# Altium schematic sheet DIMNode012014.SchDoc
size C; SheetNumber: 0; SheetTotal: 0
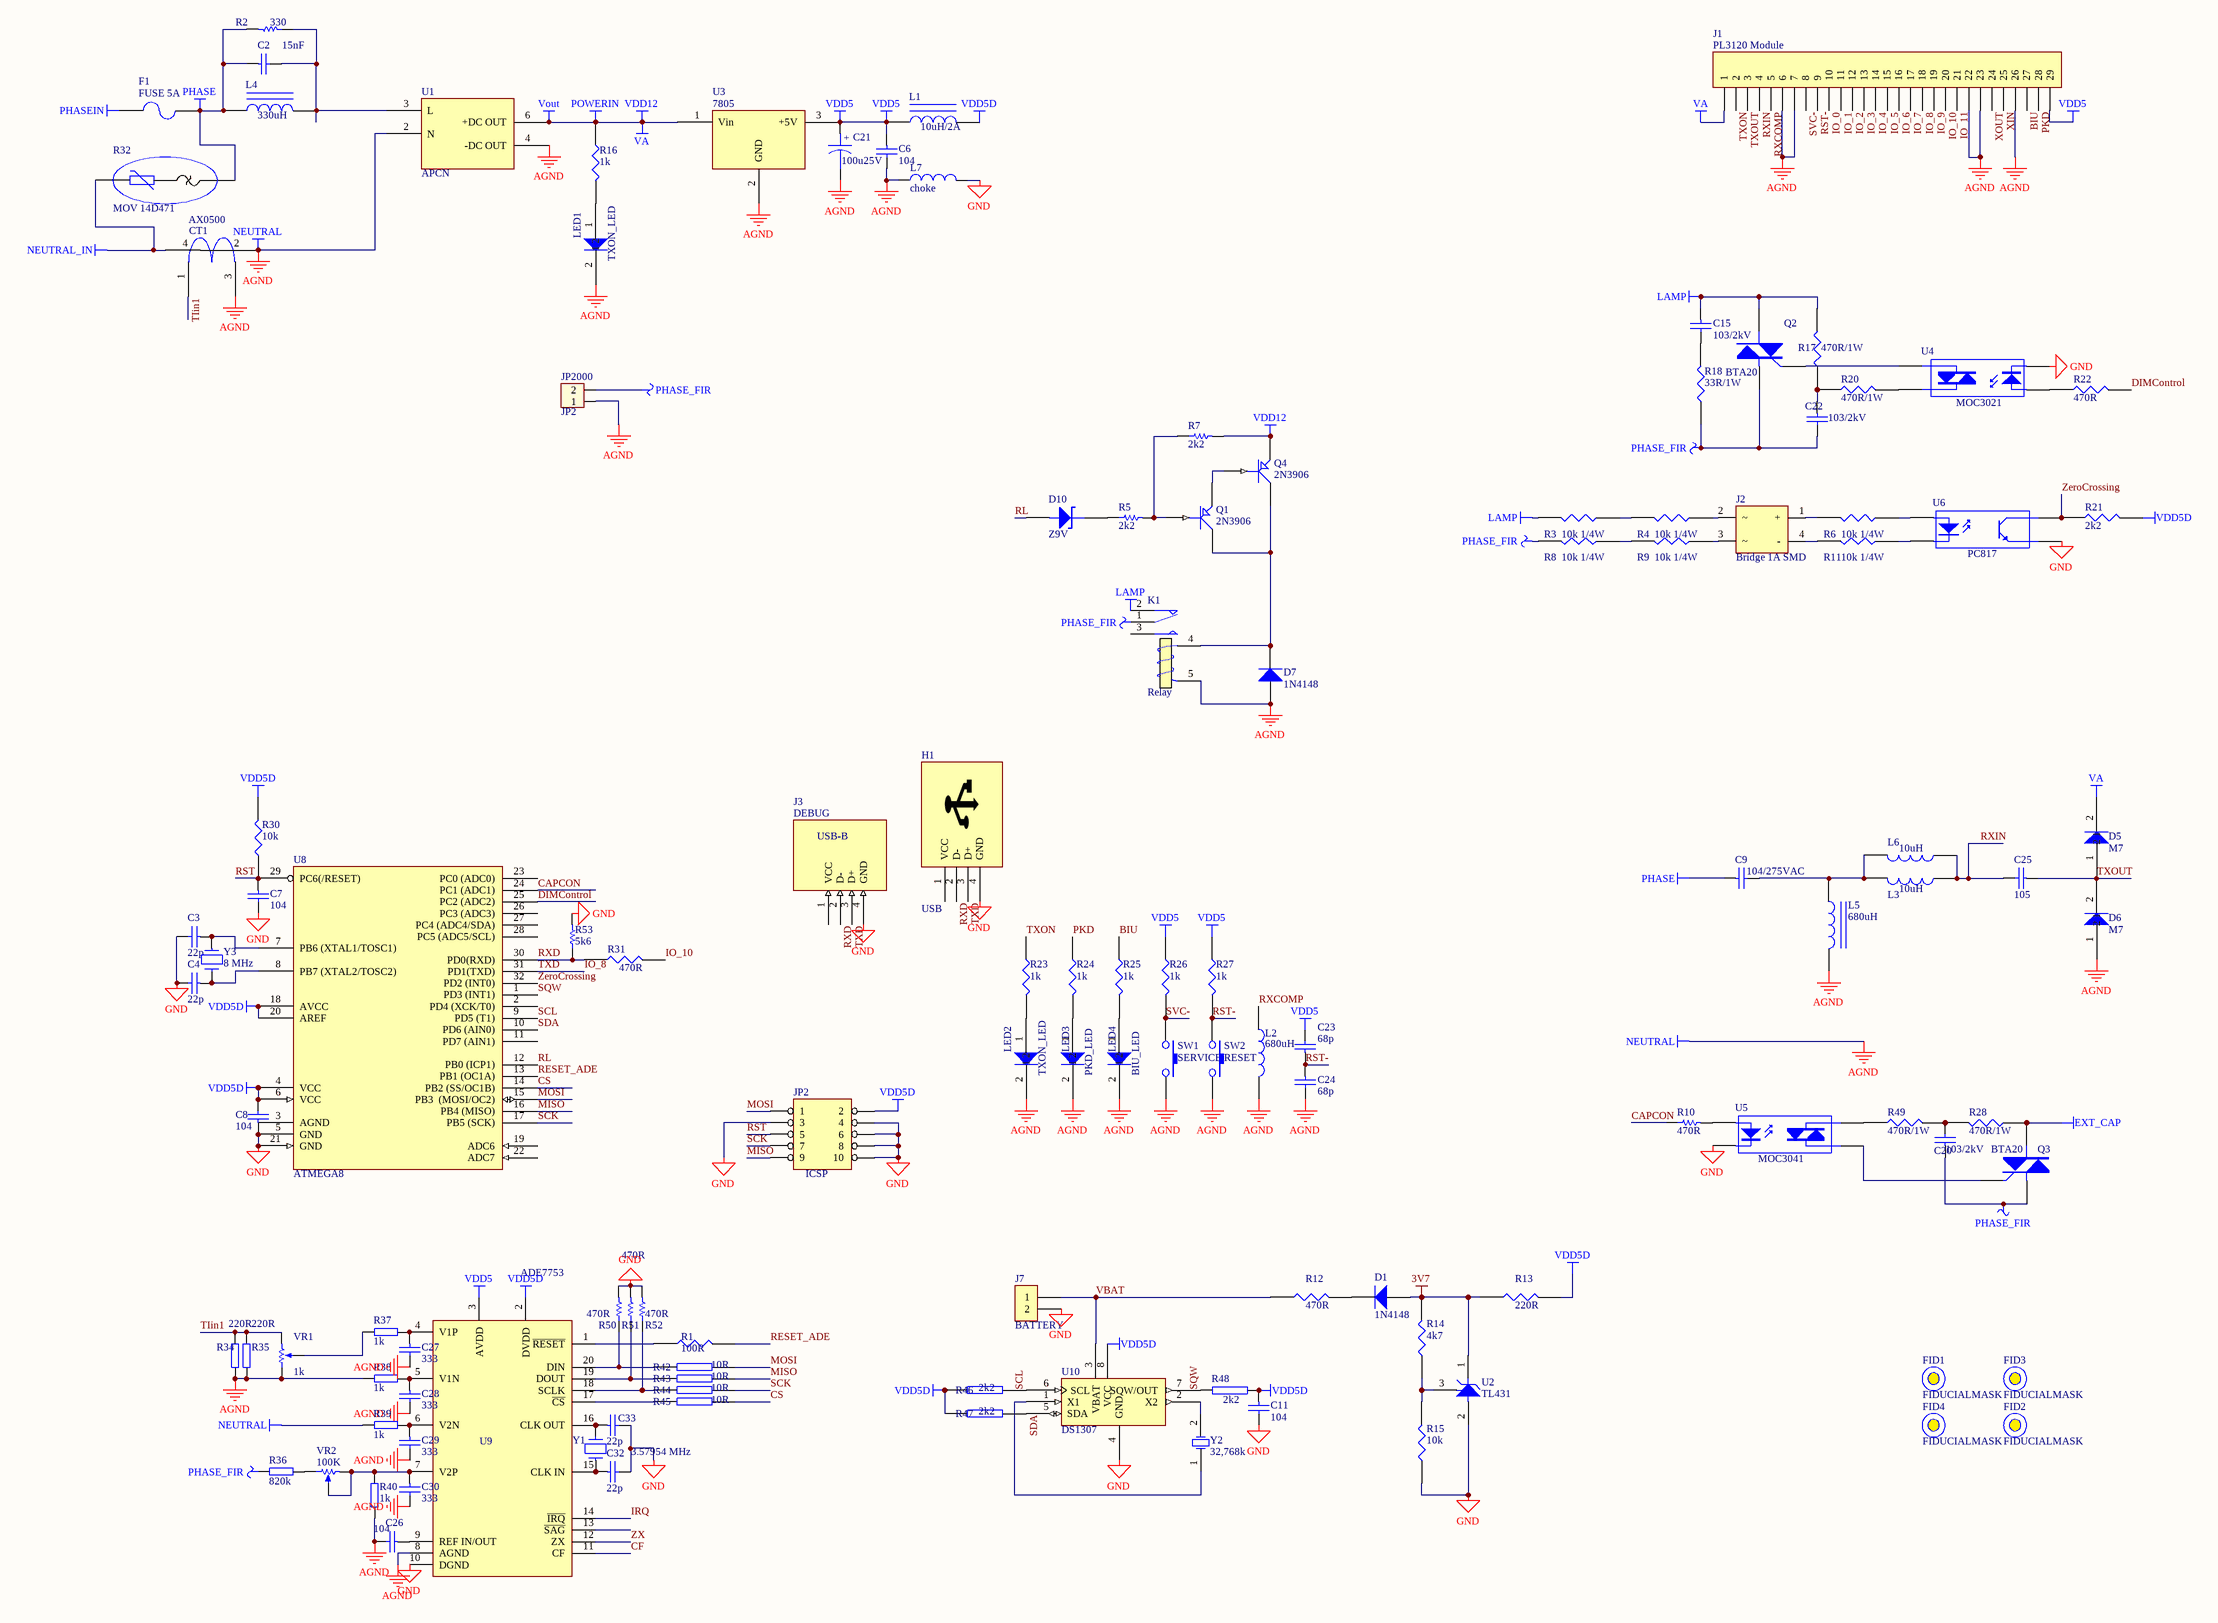
[diagram p0: DIMNode012014.SchDoc]

## Parts
C2  15nF  [CAPNTO5.08-7.37x3.94]
C3  22p  [2012[0805]]
C4  22p  [2012[0805]]
C6  104  [2012[0805]]
C7  104  [2012[0805]]
C8  104  [2012[0805]]
C9  104/275VAC  [100n400v]
C11  104  [2012[0805]]
C15  103/2kV  [104TO]
C20  103/2kV  [104TO]
C21  100u25V  [TC7360-2924]
C22  103/2kV  [104TO]
C23  68p  [2012[0805]]
C24  68p  [2012[0805]]
C25  105  [CSIP3]
C26  104  [2012[0805]]
C27  333  [2012[0805]]
C28  333  [2012[0805]]
C29  333  [2012[0805]]
C30  333  [2012[0805]]
C32  22p  [2012[0805]]
C33  22p  [2012[0805]]
CT1  AX0500  [CT-NHO]
D1  1N4148  [SOD-80/MLL34]
D5  M7  [MELF-D5022-2009]
D6  M7  [MELF-D5022-2009]
D7  1N4148  [SOD-80/MLL34]
D10  Z9V  [SOD-80/MLL34]
F1  FUSE 5A  [FUSE2]
FID1  FIDUCIALMASK  [FIDUCIALMASK]
FID2  FIDUCIALMASK  [FIDUCIALMASK]
FID3  FIDUCIALMASK  [FIDUCIALMASK]
FID4  FIDUCIALMASK  [FIDUCIALMASK]
H1  USB  [USB-B-STRANGE]
J1  PL3120 Module  [ECHELONMODULE]
J2  Bridge 1A SMD  [CAUSMD]
J3  DEBUG  [SJ-3515]
J7  BATTERY  [pincucao]
JP2  ICSP  [IDC10]
JP2000  JP2  [HED2]
K1  Relay  [Relayvuong]
L1  10uH/2A
L2  680uH  [AXIAL0.4]
L3  10uH  [AXIAL0.4]
L4  330uH  [CAMTRONDUNG]
L5  680uH  [axial0.4]
L6  10uH  [AXIAL0.4]
L7  choke  [axial0.3]
LED1  TXON_LED  [LED0805]
LED2  TXON_LED  [LED0805]
LED3  PKD_LED  [LED0805]
LED4  BIU_LED  [LED0805]
Q1  2N3906  [SOT-23]
Q2  BTA20  [TO254]
Q3  BTA20  [TO254]
Q4  2N3906  [SOT-23]
R1  100R  [2012[0805]]
R2  330  [3216[1206]]
R3  10k 1/4W  [3216[1206]]
R4  10k 1/4W  [3216[1206]]
R5  2k2  [2012[0805]]
R6  10k 1/4W  [3216[1206]]
R7  2k2  [2012[0805]]
R8  10k 1/4W  [3216[1206]]
R9  10k 1/4W  [3216[1206]]
R10  470R  [2012[0805]]
R11  10k 1/4W  [3216[1206]]
R12  470R  [2012[0805]]
R13  220R  [2012[0805]]
R14  4k7  [2012[0805]]
R15  10k  [2012[0805]]
R16  1k  [2012[0805]]
R17  470R/1W  [AXIAL0.5]
R18  33R/1W  [R1W_dung]
R20  470R/1W  [R1W_DUNG]
R21  2k2  [2012[0805]]
R22  470R  [2012[0805]]
R23  1k  [2012[0805]]
R24  1k  [2012[0805]]
R25  1k  [2012[0805]]
R26  1k  [2012[0805]]
R27  1k  [2012[0805]]
R28  470R/1W  [R1W_dung]
R30  10k  [2012[0805]]
R31  470R  [2012[0805]]
R32  MOV 14D471  [MOV471]
R34  220R  [2012[0805]]
R35  220R  [2012[0805]]
R36  820k  [1206]
R37  1k  [2012[0805]]
R38  1k  [2012[0805]]
R39  1k  [2012[0805]]
R40  1k  [2012[0805]]
R42  10R  [2012[0805]]
R43  10R  [2012[0805]]
R44  10R  [2012[0805]]
R45  10R  [2012[0805]]
R46  2k2  [2012[0805]]
R47  2k2  [2012[0805]]
R48  2k2  [2012[0805]]
R49  470R/1W  [R1W_DUNG]
R50  470R  [2012[0805]]
R51  470R  [2012[0805]]
R52  470R  [2012[0805]]
R53  5k6  [2012[0805]]
SW1  SERVICE  [CTCHIPNGANG]
SW2  RESET  [CTCHIPNGANG]
U1  APCN  [APCN]
U2  TL431  [TL431]
U3  7805  [J7805]
U4  MOC3021  [DIP6]
U5  MOC3041  [DIP6]
U6  PC817  [TLP521]
U8  ATMEGA8  [ATMEGA8]
U9  ADE7753  [ADE775X]
U10  DS1307  [SO-8]
VR1  1k  [BTXANH]
VR2  100K  [BTXANH]
Y1  3.57954 MHz  [XTAL]
Y2  32,768k  [R38]
Y3  8 MHz  [XTAL]

## Nets
3V7: D1.1(A) R13.1 R14.2 U2.1(K)
AGND: C6.2 C21.2 C24.2 C26.2 C27.2 C28.2 C29.2 C30.2 CT1.2(ACin) CT1.3(OUT2) D6.1 D7.1(A) J1.6 J1.7 J1.22 J1.23 J1.26 JP2000.1 K1.5(T2) L2.2 L5.2 L7.1 LED1.2 LED2.2 LED3.2 LED4.2 R34.1 R35.1 R38.2 R39.2 R40.1 SW1.2 SW2.2 U1.2(N) U1.4(-DC_OUT) U3.2(GND) U9.8(AGND) VR1.1(TOP)  [also labelled NEUTRAL]
EXT_CAP: Q3.2(T) R28.1
GND: C3.2 C4.2 C7.2 C8.1 C11.2 C32.2 C33.2 H1.4(GND) J3.4(GND) J7.2 JP2.3 JP2.4 JP2.6 JP2.8 JP2.10 L7.2 R15.1 R50.2 R51.2 R52.2 R53.2 U2.2(A) U4.2(K) U5.2(K) U6.4(E) U8.3(AGND) U8.5(GND) U8.21(GND) U9.10(DGND) U10.4(GND)
LAMP: C15.1 K1.2(NC) Q2.2(T) R3.2 R17.2
NEUTRAL_IN: CT1.4(ACout) R32.2
PHASE: C2.1 C9.1 F1.2 L4.1 R2.2 R32.1
PHASE_FIR: C20.1 C22.2 JP2000.2 K1.1(COM) Q2.1(T) Q3.1(T) R8.2 R18.1 R36.2
PHASEIN: F1.1
POWERIN: D5.2 J1.1 Q4.2(E) R7.2 R16.1 U1.6(+DC_OUT) U3.1(Vin)  [also labelled VA, VDD12, Vout]
VDD5: C6.1 C21.1 C23.2 J1.29 L1.1 R26.1 R27.1 U3.3(+5V) U9.3(AVDD)
VDD5D: C8.2 C11.1 JP2.2 L1.2 R13.2 R21.2 R30.2 R46.2 R47.2 R48.2 U8.4(VCC) U8.6(VCC) U8.18(AVCC) U8.20(AREF) U9.2(DVDD) U10.8(VCC)
BIU: J1.27 R25.1
CAPCON: R10.1 U8.24(PC1_(ADC1))
CF: U9.11(CF)
CS: R45.1 U8.14(PB2_(SS/OC1B))
DIMControl: R22.2 U8.25(PC2_(ADC2))
IO_0: J1.10
IO_1: J1.11
IO_2: J1.12
IO_3: J1.13
IO_4: J1.14
IO_5: J1.15
IO_6: J1.16
IO_7: J1.17
IO_8: H1.3(D+) J1.18 J3.3(D+) U8.31(PD1(TXD))  [also labelled TXD]
IO_9: J1.19
IO_10: J1.20 R31.2
IO_11: J1.21
IRQ: U9.14(~{IRQ})
MISO: JP2.9 R43.1 U8.16(PB4_(MISO))
MOSI: JP2.1 R42.1 U8.15(PB3__(MOSI/OC2))
PKD: J1.28 R24.1
RESET_ADE: R1.2 U8.13(PB1_(OC1A))
RL: D10.1(A) U8.12(PB0_(ICP1))
RST: C7.1 JP2.5 R30.1 U8.29(PC6(/RESET))
RST-: C23.1 C24.1 J1.9 R27.2 SW2.1
RXCOMP: J1.5 L2.1
RXD: H1.2(D-) J3.2(D-) R31.1 R53.1 U8.30(PD0(RXD))
RXIN: C25.2 J1.4 L3.1 L6.1
SCK: JP2.7 R44.1 U8.17(PB5_(SCK))
SCL: R46.1 U8.9(PD5_(T1)) U10.6(SCL)
SDA: R47.1 U8.10(PD6_(AIN0)) U10.5(SDA)
SQW: R48.1 U8.1(PD3_(INT1)) U10.7(SQW/OUT)
SVC-: J1.8 R26.2 SW1.1
TIin1: CT1.1(OUT1) R34.2 R35.2 VR1.3(BOT)
TXON: J1.2 R23.1
TXOUT: C25.1 D5.1 D6.2 J1.3
VBAT: J7.1 R12.1 U10.3(VBAT)
XIN: J1.25
XOUT: J1.24
ZeroCrossing: R21.1 U6.3(C) U8.32(PD2_(INT0))
ZX: U9.12(ZX)
NetC2_2: C2.2 L4.2 R2.1 U1.3(L)
NetC3_1: C3.1 U8.7(PB6_(XTAL1/TOSC1)) Y3.1
NetC4_1: C4.1 U8.8(PB7_(XTAL2/TOSC2)) Y3.2
NetC9_2: C9.2 L3.2 L5.1 L6.2
NetC15_2: C15.2 R18.2
NetC20_2: C20.2 R28.2 R49.2
NetC22_1: C22.1 R17.1 R20.1
NetC26_1: C26.1 U9.9(REF_IN/OUT)
NetC27_1: C27.1 R37.1 U9.4(V1P)
NetC28_1: C28.1 R38.1 U9.5(V1N)
NetC29_1: C29.1 R39.1 U9.6(V2N)
NetC30_1: C30.1 R40.2 U9.7(V2P) VR2.2(TAP) VR2.3(BOT)
NetC32_1: C32.1 U9.15(CLK_IN) Y1.1
NetC33_1: C33.1 U9.16(CLK_OUT) Y1.2
NetD1_2: D1.2(K) R12.2
NetD7_2: D7.2(K) K1.4(T1) Q1.3(C) Q4.3(C)
NetD10_2: D10.2(K) R5.1
NetJ2_1: J2.1(+) R6.2
NetJ2_2: J2.2 R4.1
NetJ2_3: J2.3 R9.1
NetJ2_4: J2.4(-) R11.2
NetLED1_1: LED1.1 R16.2
NetLED2_1: LED2.1 R23.2
NetLED3_1: LED3.1 R24.2
NetLED4_1: LED4.1 R25.2
NetQ1_1: Q1.1(B) R5.2 R7.1
NetQ1_2: Q1.2(E) Q4.1(B)
NetQ2_3: Q2.3(G) U4.4(A/K)
NetQ3_3: Q3.3(G) U5.4(A/K)
NetR1_1: R1.1 U9.1(~{RESET})
NetR3_1: R3.1 R4.2
NetR6_1: R6.1 U6.1(A)
NetR8_1: R8.1 R9.2
NetR10_2: R10.2 U5.1(A)
NetR11_1: R11.1 U6.2(K)
NetR14_1: R14.1 R15.2 U2.3(R)
NetR20_2: R20.2 U4.6(A/K)
NetR22_1: R22.1 U4.1(A)
NetR36_1: R36.1 VR2.1(TOP)
NetR37_2: R37.2 VR1.2(TAP)
NetR42_2: R42.2 R50.1 U9.20(DIN)
NetR43_2: R43.2 R51.1 U9.19(DOUT)
NetR44_2: R44.2 R52.1 U9.18(SCLK)
NetR45_2: R45.2 U9.17(~{CS})
NetR49_1: R49.1 U5.6(A/K)
NetU10_1: U10.1(X1) Y2.1(OSC1)
NetU10_2: U10.2(X2) Y2.2(OSC2)

Not connected (* = marked no-connect by the designer): H1 1(VCC) 5 6; J3 1(VCC); K1 3(NO); U8 2(PD4_(XCK/T0)) 11(PD7_(AIN1)) 19(ADC6) 22(ADC7) 23(PC0_(ADC0)) 26(PC3_(ADC3)) 27(PC4_(ADC4/SDA)) 28(PC5_(ADC5/SCL)); U9 13(~{SAG})

## Notes on the sheet
- (in symbol CAPACITOR POL) +
- (in symbol USB_B) USB-B

## Library data of the parts
C2 C6-C9 C11 C15 C20 C22-C25 = CAP: Capacitor
C3 C4 C26-C30 C32 C33 = CAP
C21 = CAPACITOR POL: Capacitor
CT1 = AX-0500
D1 D7 = Diode 1N4007: 1 Amp General Purpose Rectifier; Published: 8-Jun-2000; LatestRevisionDate: 17-Jul-2002; LatestRevisionNote: Re-released for DXP Platform.; DatasheetDocument: 1998; PackageDocument: Aug-1999; PackageReference: DO-41; Publisher: Altium Limited; Code_JEDEC: DO-204-AL; ComponentLink1Description: Manufacturer Link; ComponentLink1URL: http://www.fairchildsemi.com/; ComponentLink2Description: Datasheet; ComponentLink2URL: http://www.fairchildsemi.com/ds/1N%2F1N4001.pdf
D5 D6 LED1-LED4 = DIODE
D10 = ZENER2: Zener Diode
F1 = FUSE2: Fuse
J1 = CON29: Connector
J2 = Diode Bridge Flate: Diode Bridge
J3 = USB_B: pin to pad: 1>3 3>4 4>1
J7 = CON2: Connector
JP2 = HEADER 5X2
JP2000 = Con2: Connector 2; Value: Connector 2
K1 = Relay: SPDT Relay; Published: 8-Jun-2000; LatestRevisionDate: 17-Jul-2002; LatestRevisionNote: Re-released for DXP Platform.; PackageReference: MODULE5B; Publisher: Altium Limited
L1 L4 L5 = INDUCTOR IRON
L2 L3 L6 = INDUCTOR
L7 = Inductor: Code_IEC: 1005; Published: 8-Jun-2000; LatestRevisionDate: 29-May-2009; LatestRevisionNote: IPC-7351 Footprint Added.; PackageReference: 0402-A; Publisher: Altium Limited; PackageDescription: Chip Inductor; Code_JEITA: 0402; Value: choke
Q1 Q4 = PNP1: PNP Transistor
Q2 Q3 = TRIAC
R1 R3 R4 R6 R8 R9 R11-R18 R20-R28 R30 R31 R49 = RES1
R2 R10 = Res Semi: Semiconductor Resistor; Value: 2K2; Published: 8-Jun-2000; LatestRevisionDate: 17-Jul-2002; LatestRevisionNote: Re-released for DXP Platform.; PackageReference: AXIAL-0.5; Publisher: Altium Limited
R5 R50-R53 = Res Semi: Semiconductor Resistor
  R5: Published: 8-Jun-2000; LatestRevisionDate: 17-Jul-2002; LatestRevisionNote: Re-released for DXP Platform.; PackageReference: AXIAL-0.5; Publisher: Altium Limited; Value: 2K2
  R50-R53: Published: *; LatestRevisionDate: *; LatestRevisionNote: *; PackageReference: *; Publisher: *; Value: *
R7 = Res Semi: Semiconductor Resistor; Value: 10K; Published: 8-Jun-2000; LatestRevisionDate: 17-Jul-2002; LatestRevisionNote: Re-released for DXP Platform.; PackageReference: AXIAL-0.5; Publisher: Altium Limited
R32 = MOV
R34-R40 R42-R48 = RES2
SW1 SW2 = SW-PB
U1 = Component_1
U2 = TL431: Adjustable Precision Shunt Regulator
U3 = MC7805T
U4 U5 = OPTOTRIAC
U6 = OPTOISO1: Optoisolator
U8 = ATMEGA8-A: TQFP package
U9 = ADE775X
U10 = DS1307(8): 64x8 SERIAL REAL TIME CLOCK
VR1 VR2 = RPot: Potentiometer; Published: *; LatestRevisionDate: *; LatestRevisionNote: *; PackageReference: *; Publisher: *; Sim Note: *; Set Position: *; Value: *
Y1 Y3 = CRYSTAL
Y2 = XTAL: Crystal Oscillator; Published: 8-Jun-2000; LatestRevisionDate: 17-Jul-2002; LatestRevisionNote: Re-released for DXP Platform.; PackageReference: R38; Publisher: Altium Limited; PackageDescription: Crystal, Thru-Hole; 2 Leads; Body 3.1 x 8.2 mm (Dia.xH)